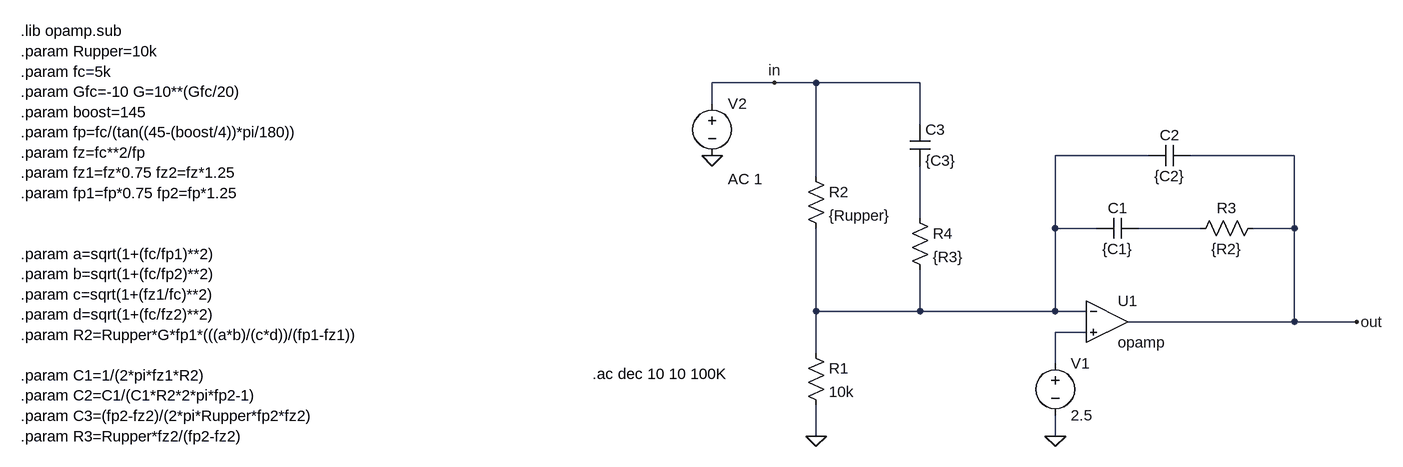
[diagram p0: schematic opa3p2z.asc]
opa3p2z.asc, the LTspice schematic file:
Version 4.1
SHEET 1 1252 680
WIRE 192 -32 96 -32
WIRE 256 -32 192 -32
WIRE 416 -32 256 -32
WIRE 96 0 96 -32
WIRE 416 32 416 -32
WIRE 768 80 624 80
WIRE 992 80 832 80
WIRE 256 112 256 -32
WIRE 416 176 416 96
WIRE 624 192 624 80
WIRE 688 192 624 192
WIRE 848 192 752 192
WIRE 992 192 992 80
WIRE 992 192 928 192
WIRE 256 320 256 192
WIRE 416 320 416 256
WIRE 416 320 256 320
WIRE 624 320 624 192
WIRE 624 320 416 320
WIRE 672 320 624 320
WIRE 992 336 992 192
WIRE 992 336 736 336
WIRE 1088 336 992 336
WIRE 672 352 624 352
WIRE 256 384 256 320
WIRE 624 400 624 352
WIRE 256 512 256 464
WIRE 624 512 624 480
FLAG 256 512 0
FLAG 624 512 0
FLAG 1088 336 out
FLAG 96 80 0
FLAG 192 -32 in
SYMBOL OpAmps\\opamp 704 272 R0
SYMATTR InstName U1
SYMBOL voltage 624 384 R0
WINDOW 123 0 0 Left 0
WINDOW 39 0 0 Left 0
SYMATTR InstName V1
SYMATTR Value 2.5
SYMBOL res 240 368 R0
SYMATTR InstName R1
SYMATTR Value 10k
SYMBOL res 240 96 R0
SYMATTR InstName R2
SYMATTR Value {Rupper}
SYMBOL cap 752 176 R90
WINDOW 0 0 32 VBottom 2
WINDOW 3 32 32 VTop 2
SYMATTR InstName C1
SYMATTR Value {C1}
SYMBOL res 944 176 R90
WINDOW 0 0 56 VBottom 2
WINDOW 3 32 56 VTop 2
SYMATTR InstName R3
SYMATTR Value {R2}
SYMBOL cap 832 64 R90
WINDOW 0 0 32 VBottom 2
WINDOW 3 32 32 VTop 2
SYMATTR InstName C2
SYMATTR Value {C2}
SYMBOL voltage 96 -16 R0
WINDOW 123 24 132 Left 2
WINDOW 39 0 0 Left 0
SYMATTR Value2 AC 1
SYMATTR InstName V2
SYMATTR Value ""
SYMBOL res 400 160 R0
SYMATTR InstName R4
SYMATTR Value {R3}
SYMBOL cap 400 32 R0
SYMATTR InstName C3
SYMATTR Value {C3}
TEXT -968 -112 Left 2 !.lib opamp.sub\n.param Rupper=10k\n.param fc=5k\n.param Gfc=-10 G=10**(Gfc/20)\n.param boost=145\n.param fp=fc/(tan((45-(boost/4))*pi/180))\n.param fz=fc**2/fp\n.param fz1=fz*0.75 fz2=fz*1.25\n.param fp1=fp*0.75 fp2=fp*1.25\n \n \n.param a=sqrt(1+(fc/fp1)**2)\n.param b=sqrt(1+(fc/fp2)**2)\n.param c=sqrt(1+(fz1/fc)**2)\n.param d=sqrt(1+(fc/fz2)**2)\n.param R2=Rupper*G*fp1*(((a*b)/(c*d))/(fp1-fz1))\n \n.param C1=1/(2*pi*fz1*R2)\n.param C2=C1/(C1*R2*2*pi*fp2-1)\n.param C3=(fp2-fz2)/(2*pi*Rupper*fp2*fz2)\n.param R3=Rupper*fz2/(fp2-fz2)
TEXT -88 416 Left 2 !.ac dec 10 10 100K

The netlist it stands for:
* opa3p2z.asc
X§U1 N001 N004 out opamp Aol=100K GBW=10Meg  ; pins invin noninvin out
V1 N004 0 2.5
R1 N001 0 10k
R2 in N001 {Rupper}
C1 N003 N001 {C1}
R3 out N003 {R2}
C2 out N001 {C2}
V2 in 0 AC 1
R4 N002 N001 {R3}
C3 in N002 {C3}
.lib opamp.sub
.param Rupper=10k
.param fc=5k
.param Gfc=-10 G=10**(Gfc/20)
.param boost=145
.param fp=fc/(tan((45-(boost/4))*pi/180))
.param fz=fc**2/fp
.param fz1=fz*0.75 fz2=fz*1.25
.param fp1=fp*0.75 fp2=fp*1.25
.param a=sqrt(1+(fc/fp1)**2)
.param b=sqrt(1+(fc/fp2)**2)
.param c=sqrt(1+(fz1/fc)**2)
.param d=sqrt(1+(fc/fz2)**2)
.param R2=Rupper*G*fp1*(((a*b)/(c*d))/(fp1-fz1))
.param C1=1/(2*pi*fz1*R2)
.param C2=C1/(C1*R2*2*pi*fp2-1)
.param C3=(fp2-fz2)/(2*pi*Rupper*fp2*fz2)
.param R3=Rupper*fz2/(fp2-fz2)
.ac dec 10 10 100K
.backanno
.end